# Altium schematic sheet POWER.SchDoc
size A4
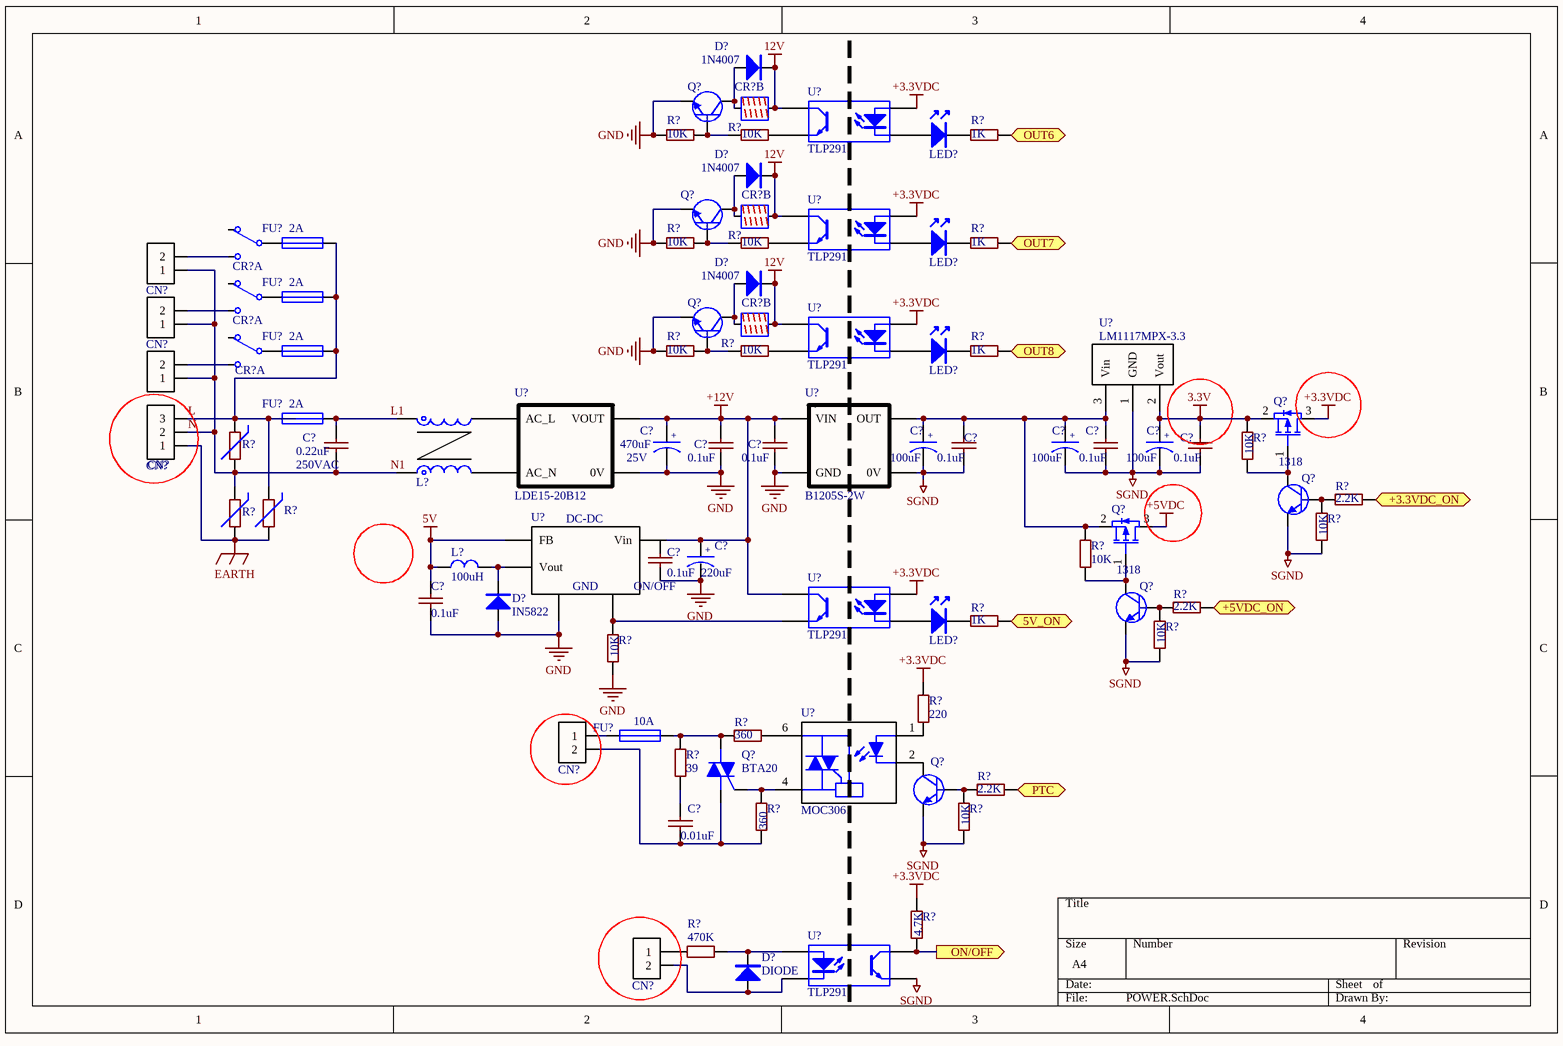
[diagram p0: POWER.SchDoc]

## Parts
(Parts that share a designator on the sheet are numbered #1, #2 ... from top to bottom, then left to right.)
C?#1  470uF  [HONOR_10X105]
C?#2  100uF  [HONOR_63X54]
C?#3  100uF  [HONOR_63X54]
C?#4  100uF  [HONOR_63X54]
C?#5  0.22uF  耐压: 250VAC  [0603_C]
C?#6  0.1uF  [0603_C]
C?#7  0.1uF  [0603_C]
C?#8  0.1uF  [0603_C]
C?#9  0.1uF  [0603_C]
C?#10  0.1uF  [0603_C]
C?#11  220uF  [HONOR_63X54]
C?#12  0.1uF  [0603_C]
C?#13  0.1uF  [0603_C]
C?#14  0.01uF  [0603_C]
CN?#1  CON2  [WJ128V-2P]  (value not drawn)
CN?#2  CON2  [WJ128V-2P]  (value not drawn)
CN?#3  CON2  [WJ128V-2P]  (value not drawn)
CN?#4  CON3  [HB9500-3P]  (value not drawn)
CN?#5  CON2  [HB9500-2P]  (value not drawn)
CN?#6  CON2  [HB9500-2P]  (value not drawn)
CR?#1  继电器  [G5Q-14]  (value not drawn)  (part B of 2)
CR?#2  继电器  [G5Q-14]  (value not drawn)  (part B of 2)
CR?#3  继电器  [G5Q-14]  (value not drawn)  (part A of 2)
CR?#4  继电器  [G5Q-14]  (value not drawn)  (part A of 2)
CR?#5  继电器  [G5Q-14]  (value not drawn)  (part B of 2)
CR?#6  继电器  [G5Q-14]  (value not drawn)  (part A of 2)
D?#1  1N4007  [MUR]
D?#2  1N4007  [MUR]
D?#3  1N4007  [MUR]
D?#4  IN5822  [二极管SOD-123]
D?#5  DIODE  [MUR]
FU?#1  2A  [BX]
FU?#2  2A  [BX]
FU?#3  2A  [BX]
FU?#4  2A  [BX]
FU?#5  10A  [BX]
L?#1  共模电感  [FL2D-Z5-103]  (value not drawn)
L?#2  100uH  [0603_L]
LED?#1  Led  [0603_LED]  (value not drawn)
LED?#2  Led  [0603_LED]  (value not drawn)
LED?#3  Led  [0603_LED]  (value not drawn)
LED?#4  Led  [0603_LED]  (value not drawn)
Q?#1  1318  [SOT-23]  (value not drawn)
Q?#2  1318  [SOT-23]  (value not drawn)
Q?#3  1318  [SOT-23]  (value not drawn)
Q?#4  MOS_P  [SOT-23]  (value not drawn)
Q?#5  1318  [SOT-23]
Q?#6  MOS_P  [SOT-23]  (value not drawn)
Q?#7  1318  [SOT-23]
Q?#8  BTA20
Q?#9  1318  [SOT-23]  (value not drawn)
R?#1  10K  [0603_R]
R?#2  10K  [0603_R]
R?#3  1K  [0603_R]
R?#4  10K  [0603_R]
R?#5  10K  [0603_R]
R?#6  1K  [0603_R]
R?#7  10K  [0603_R]
R?#8  10K  [0603_R]
R?#9  1K  [0603_R]
R?#10  431K10D  [RAD0.2]  (value not drawn)
R?#11  10K  [1206_R]
R?#12  2.2K  [1206_R]
R?#13  431K10D  [RAD0.2]  (value not drawn)
R?#14  431K10D  [RAD0.2]  (value not drawn)
R?#15  10K  [1206_R]
R?#16  10K  [1206_R]
R?#17  2.2K  [1206_R]
R?#18  1K  [1206_R]
R?#19  10K  [1206_R]
R?#20  10K  [1206_R]
R?#21  220  [1206_R]
R?#22  360  [1206_R]
R?#23  39  [1206_R]
R?#24  2.2K  [1206_R]
R?#25  360  [1206_R]
R?#26  10K  [1206_R]
R?#27  4.7K  [1206_R]
R?#28  470K  [0603_R]
U?#1  TLP291  [sop-4]
U?#2  TLP291  [sop-4]
U?#3  TLP291  [sop-4]
U?#4  LM1117MPX-3.3  [SOT-223]
U?#5  LDE15-20B12  [LDE15]
U?#6  B1205S-2W  [DCDC-BS2W]
U?#7  DC-DC  [TO-263-5L]
U?#8  TLP291  [sop-4]
U?#9  MOC3061  [SMT-6PIN]
U?#10  TLP291  [sop-4]

## Ports
5V_ON (in), +3.3VDC_ON (in), +5VDC_ON (in), ON/OFF (out), OUT6 (in), OUT7 (in), OUT8 (in), PTC (out)

## Nets
3.3V: C?#4.1 C?#10.1 Q?#4.2(S) R?#11.1 U?#4.2(Vout)
5V: C?#13.1 L?#2.2 U?#7.4(FB)
12V: CR?#1.1 CR?#2.1 CR?#5.1 D?#1.K D?#2.K D?#3.K U?#1.4 U?#2.4 U?#3.4
+3.3VDC: Q?#4.3(D) R?#21.2 R?#27.2 U?#1.1 U?#2.1 U?#3.1 U?#8.1
+5VDC: Q?#6.3(D)
+12V: C?#1.1 C?#6.1 C?#7.1 C?#11.1 U?#5.4(VOUT) U?#6.1(VIN) U?#7.1(Vin) U?#8.4
EARTH: CN?#4.1 R?#13.1 R?#14.1
GND: C?#1.2 C?#6.2 C?#7.2 C?#11.2 C?#12.2 C?#13.2 D?#4.A Q?#1.2(E) Q?#2.2(E) Q?#3.2(E) R?#1.2 R?#4.2 R?#7.2 R?#20.2 U?#5.3(0V) U?#6.2(GND) U?#7.3(GND)
SGND: C?#2.2 C?#3.2 C?#4.2 C?#8.2 C?#9.2 C?#10.2 Q?#5.2(E) Q?#7.2(E) Q?#9.2(E) R?#15.1 R?#19.1 R?#26.1 U?#4.1(GND) U?#6.4(0V) U?#10.3
5V_ON: R?#18.1 ; port 5V_ON
+3.3VDC_ON: R?#12.1 ; port +3.3VDC_ON
+5VDC_ON: R?#17.1 ; port +5VDC_ON
L: CN?#4.3 FU?#1.2 FU?#2.2 FU?#3.2 FU?#4.1 R?#10.2 R?#14.2
L1: C?#5.1 FU?#4.2 L?#1.1
N: C?#5.2 CN?#1.1 CN?#2.1 CN?#3.1 CN?#4.2 L?#1.2 R?#10.1 R?#13.2  [also labelled N1]
ON/OFF: R?#27.1 U?#10.4 ; port ON/OFF
OUT6: R?#3.1 ; port OUT6
OUT7: R?#6.1 ; port OUT7
OUT8: R?#9.1 ; port OUT8
PTC: R?#24.1 ; port PTC
NetC?#2_1: C?#2.1 C?#3.1 C?#8.1 C?#9.1 Q?#6.2(S) R?#16.1 U?#4.3(Vin) U?#6.6(OUT)
NetC?#14_1: C?#14.1 R?#23.1
NetC?#14_2: C?#14.2 CN?#5.2 Q?#8.1(A1) R?#25.1
NetCN?#1_2: CN?#1.2 CR?#3.3
NetCN?#2_2: CN?#2.2 CR?#4.3
NetCN?#3_2: CN?#3.2 CR?#6.3
NetCN?#5_1: CN?#5.1 FU?#5.1
NetCN?#6_1: CN?#6.1 R?#28.2
NetCN?#6_2: CN?#6.2 D?#5.A U?#10.2
NetCR?#1_5: CR?#1.5 D?#1.A Q?#1.3(C)
NetCR?#2_5: CR?#2.5 D?#2.A Q?#2.3(C)
NetCR?#3_4: CR?#3.4 FU?#1.1
NetCR?#4_4: CR?#4.4 FU?#2.1
NetCR?#5_5: CR?#5.5 D?#3.A Q?#3.3(C)
NetCR?#6_4: CR?#6.4 FU?#3.1
NetD?#4_K: D?#4.K L?#2.1 U?#7.2(Vout)
NetD?#5_K: D?#5.K R?#28.1 U?#10.1
NetFU?#5_2: FU?#5.2 Q?#8.2(A2) R?#22.2 R?#23.2
NetL?#1_3: L?#1.3 U?#5.1(AC_N)
NetL?#1_4: L?#1.4 U?#5.2(AC_L)
NetLED?#1_A: LED?#1.A U?#1.2
NetLED?#1_K: LED?#1.K R?#3.2
NetLED?#2_A: LED?#2.A U?#2.2
NetLED?#2_K: LED?#2.K R?#6.2
NetLED?#3_A: LED?#3.A U?#3.2
NetLED?#3_K: LED?#3.K R?#9.2
NetLED?#4_A: LED?#4.A U?#8.2
NetLED?#4_K: LED?#4.K R?#18.2
NetQ?#1_1: Q?#1.1(B) R?#1.1 R?#2.2
NetQ?#2_1: Q?#2.1(B) R?#4.1 R?#5.2
NetQ?#3_1: Q?#3.1(B) R?#7.1 R?#8.2
NetQ?#4_1: Q?#4.1(G) Q?#5.3(C) R?#11.2
NetQ?#5_1: Q?#5.1(B) R?#12.2 R?#15.2
NetQ?#6_1: Q?#6.1(G) Q?#7.3(C) R?#16.2
NetQ?#7_1: Q?#7.1(B) R?#17.2 R?#19.2
NetQ?#8_3: Q?#8.3(G) R?#25.2 U?#9.4(MT)
NetQ?#9_1: Q?#9.1(B) R?#24.2 R?#26.2
NetQ?#9_3: Q?#9.3(C) U?#9.2(CATHODE)
NetR?#2_1: R?#2.1 U?#1.3
NetR?#5_1: R?#5.1 U?#2.3
NetR?#8_1: R?#8.1 U?#3.3
NetR?#20_1: R?#20.1 U?#7.5(ON/OFF) U?#8.3
NetR?#21_1: R?#21.1 U?#9.1(ANODE)
NetR?#22_1: R?#22.1 U?#9.6(MT)

Not connected (* = marked no-connect by the designer): C?#12 1; CR?#3 2; CR?#4 2; CR?#6 2; U?#9 3(N/C) 5(N/C)

## Notes on the sheet
- (in symbol CAP  POL) +; 25V

## Library data of the parts
C?#1 = CAP  POL: 电解电容; 松下: EEEFC1E471P
C?#2-C?#4 = CAP  POL: 电解电容; 松下: EEEHAA101WAP
C?#5-C?#10 C?#12 C?#13 = CAP: 电容; 风华: 0603CG200J500NT; 三星: CL10C200JB8NNNC; 三星: CL10B104JB8NNNC; 风华: 0603B104J500NT
C?#11 = CAP  POL: 电解电容; 松下: EEEHAA221WAP
C?#14 = CAP: 电容
CN?#1-CN?#3 CN?#5 CN?#6 = CON2: 连接器; KANGNEX(康奈克斯电气): HB9500-2P 黑色
CN?#4 = CON3: 连接器
D?#1-D?#5 = DIODE: 二极管
FU?#1-FU?#5 = FUSE1: 保险
L?#1 = 共模电感: 电感; 金升阳: FL2D-Z5-103
L?#2 = Inductor: 电感
LED?#1-LED?#4 = Led: 发光二极管
Q?#1-Q?#3 Q?#5 Q?#7 Q?#9 = NPN: 三极管
Q?#8 = BTAXX: ST(意法半导体): BTA20-600CWRG
R?#1-R?#9 R?#28 = RES: 电阻
R?#10 R?#13 R?#14 = 压敏电阻
R?#11 R?#12 R?#15-R?#22 R?#24-R?#27 = RES: 电阻; 风华: RS-06K3600FT
R?#23 = RES: 电阻; 风华: RS-06K390JT
U?#4 = LM1117MPX-3.3: LM1117 3.3V固定输出
U?#5 = LDE15-20B12: 220转12V AC模块
U?#6 = B1205S-2W: 12V转5V电源隔离模块
U?#7 = LM2576: 降压模块3A
U?#9 = MOC3061: ON(安森美): MOC3061SR2M
CR?#1-CR?#6 = 继电器: Published: 24-Mar-1999; LatestRevisionDate: 17-Jul-2002; LatestRevisionNote: Re-released for DXP Platform.; PackageReference: DIP-P8; Publisher: Altium Limited